# Altium project tnb_mns_slave.PrjPcb
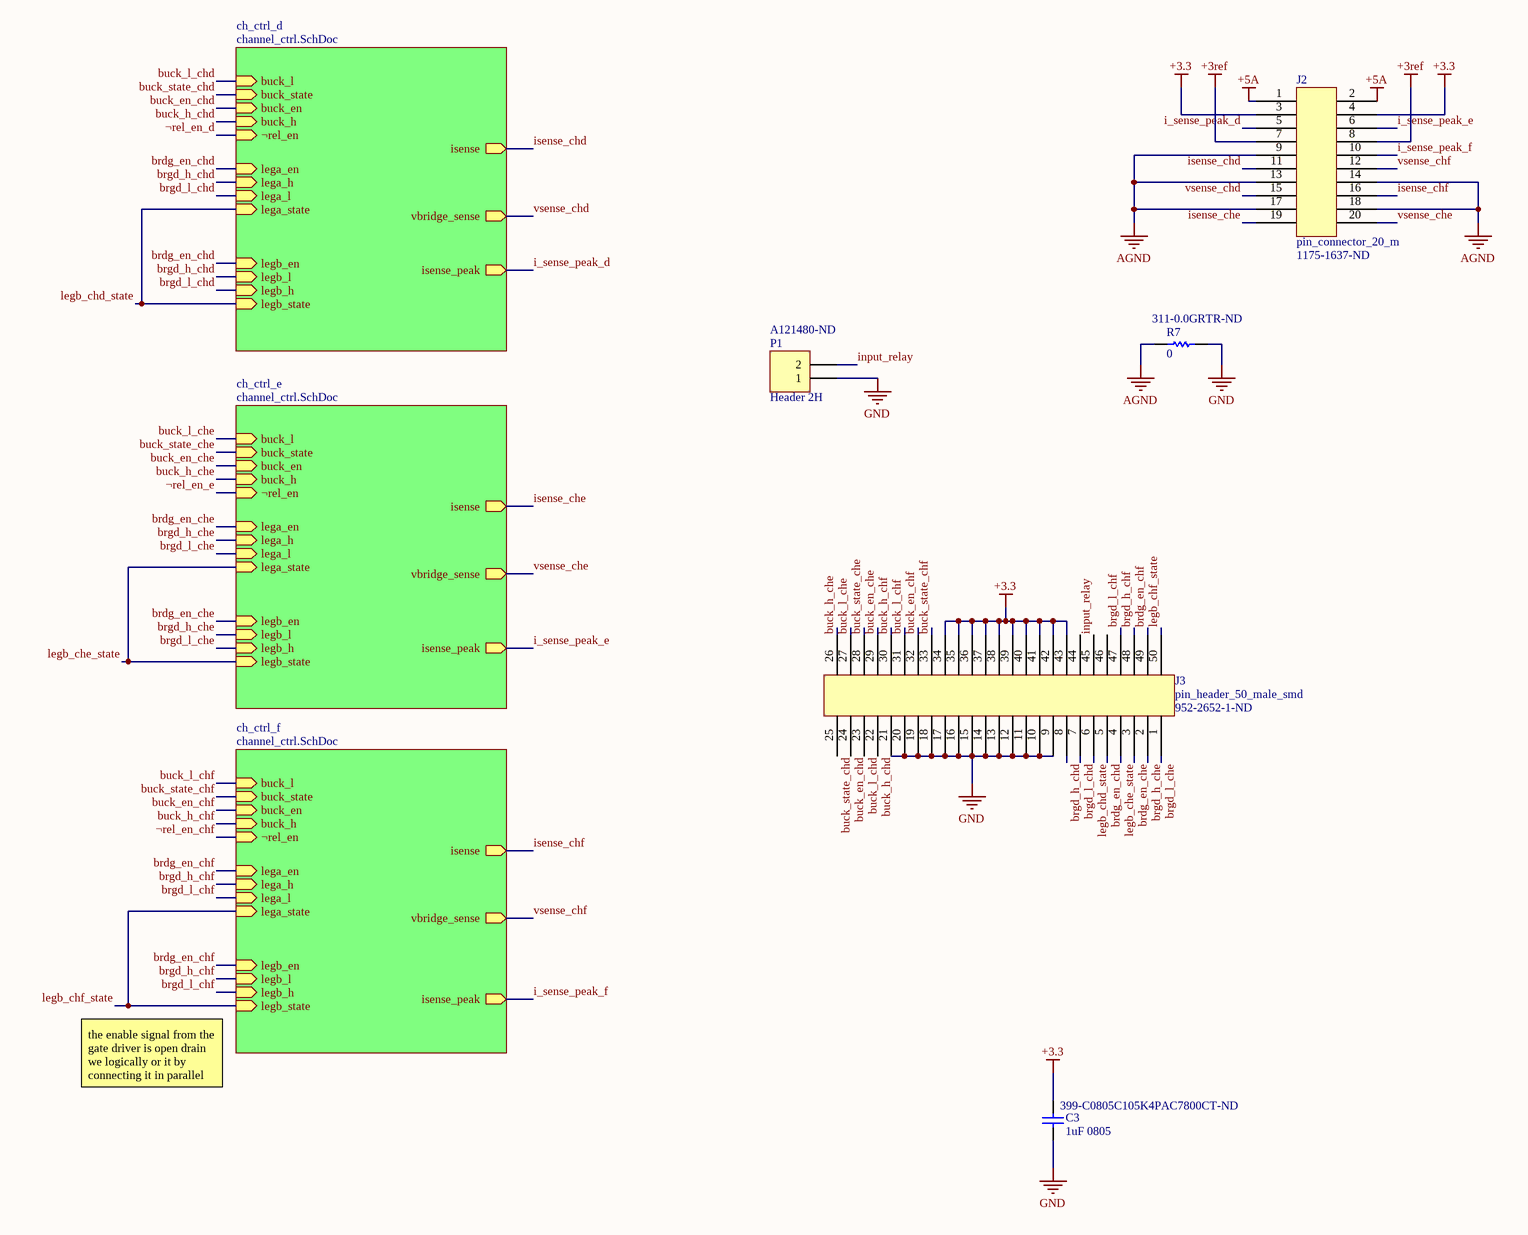
[diagram p0: tnb_mns_slave.SchDoc]
3 sheets, 92 parts. Net scope: hierarchical (ports join the sheet entries above them; power ports are global).
Board file: slave_card_pcb.PcbDoc
Sheets:
  tnb_mns_slave.SchDoc
    ch_ctrl_e = channel_ctrl.SchDoc
      isns = current_sense.SchDoc
    ch_ctrl_d = channel_ctrl.SchDoc
      isns = current_sense.SchDoc
    ch_ctrl_f = channel_ctrl.SchDoc
      isns = current_sense.SchDoc

## Sheet tnb_mns_slave.SchDoc
size A3; SheetNumber: 1; SheetTotal: 3

### Parts
C3  1uF 0805  Supplier Part Number 1: 399-C0805C105K4PAC7800CT-ND  [Model Name]
J2  pin_connector_20_m  Supplier Part Number 1: 1175-1637-ND  [PIN_20_MALE_3220-20-0300-00]
J3  pin_header_50_male_smd  Supplier Part Number 1: 952-2652-1-ND  [pin_connector_50_m_1.27_smd]
P1  Header 2H  Supplier Part Number 1: A121480-ND  [HEADER_1_2_f]
R7  0  Supplier Part Number 1: 311-0.0GRTR-ND  [RES 0603_1608]

### Sub-sheets
ch_ctrl_d = channel_ctrl.SchDoc: buck_l (in), buck_state (in), buck_en (in), buck_h (in), lega_en (in), lega_h (in), lega_l (in), lega_state (in), legb_en (in), legb_l (in), legb_h (in), legb_state (in), isense (out), vbridge_sense (out), isense_peak (out), ¬rel_en (in)
ch_ctrl_e = channel_ctrl.SchDoc: buck_l (in), buck_state (in), buck_en (in), buck_h (in), lega_en (in), lega_h (in), lega_l (in), lega_state (in), legb_en (in), legb_l (in), legb_h (in), legb_state (in), isense (out), vbridge_sense (out), ¬rel_en (in), isense_peak (out)
ch_ctrl_f = channel_ctrl.SchDoc: buck_l (in), buck_state (in), buck_en (in), buck_h (in), lega_en (in), lega_h (in), lega_l (in), lega_state (in), legb_en (in), legb_l (in), legb_h (in), legb_state (in), isense (out), vbridge_sense (out), ¬rel_en (in), isense_peak (out)

### Nets
+3.3: C3.2 J2.3 J2.4 J3.34 J3.35 J3.36 J3.37 J3.38 J3.39 J3.40 J3.41 J3.42 J3.43
+3ref: J2.7 J2.8
+5A: J2.1 J2.2
AGND: J2.9 J2.13 J2.14 J2.17 J2.18 R7.1
GND: C3.1 J3.9 J3.10 J3.11 J3.12 J3.13 J3.14 J3.15 J3.16 J3.17 J3.18 J3.19 J3.20 J3.21 P1.1 R7.2
brdg_en_chd: J3.5 ; sheet ch_ctrl_d/lega_en, sheet ch_ctrl_d/legb_en
brdg_en_che: J3.3 ; sheet ch_ctrl_e/lega_en, sheet ch_ctrl_e/legb_en
brdg_en_chf: J3.49 ; sheet ch_ctrl_f/lega_en, sheet ch_ctrl_f/legb_en
brgd_h_chd: J3.8 ; sheet ch_ctrl_d/lega_h, sheet ch_ctrl_d/legb_l
brgd_h_che: J3.2 ; sheet ch_ctrl_e/lega_h, sheet ch_ctrl_e/legb_l
brgd_h_chf: J3.48 ; sheet ch_ctrl_f/lega_h, sheet ch_ctrl_f/legb_l
brgd_l_chd: J3.7 ; sheet ch_ctrl_d/lega_l, sheet ch_ctrl_d/legb_h
brgd_l_che: J3.1 ; sheet ch_ctrl_e/lega_l, sheet ch_ctrl_e/legb_h
brgd_l_chf: J3.47 ; sheet ch_ctrl_f/lega_l, sheet ch_ctrl_f/legb_h
buck_en_chd: J3.24 ; sheet ch_ctrl_d/buck_en  [project net buck_en]
buck_en_che: J3.29 ; sheet ch_ctrl_e/buck_en  [project net buck_en]
buck_en_chf: J3.32 ; sheet ch_ctrl_f/buck_en  [project net buck_en]
buck_h_chd: J3.22 ; sheet ch_ctrl_d/buck_h  [project net buck_h]
buck_h_che: J3.26 ; sheet ch_ctrl_e/buck_h  [project net buck_h]
buck_h_chf: J3.30 ; sheet ch_ctrl_f/buck_h  [project net buck_h]
buck_l_chd: J3.23 ; sheet ch_ctrl_d/buck_l  [project net buck_l]
buck_l_che: J3.27 ; sheet ch_ctrl_e/buck_l  [project net buck_l]
buck_l_chf: J3.31 ; sheet ch_ctrl_f/buck_l  [project net buck_l]
buck_state_chd: J3.25 ; sheet ch_ctrl_d/buck_state  [project net buck_state]
buck_state_che: J3.28 ; sheet ch_ctrl_e/buck_state  [project net buck_state]
buck_state_chf: J3.33 ; sheet ch_ctrl_f/buck_state  [project net buck_state]
i_sense_peak_d: J2.5 ; sheet ch_ctrl_d/isense_peak
i_sense_peak_e: J2.6 ; sheet ch_ctrl_e/isense_peak
i_sense_peak_f: J2.10 ; sheet ch_ctrl_f/isense_peak
input_relay: J3.45 P1.2
isense_chd: J2.11 ; sheet ch_ctrl_d/isense  [project net i_sense]
isense_che: J2.19 ; sheet ch_ctrl_e/isense  [project net i_sense]
isense_chf: J2.16 ; sheet ch_ctrl_f/isense  [project net i_sense]
legb_chd_state: J3.6 ; sheet ch_ctrl_d/lega_state, sheet ch_ctrl_d/legb_state  [project net lega_state]
legb_che_state: J3.4 ; sheet ch_ctrl_e/lega_state, sheet ch_ctrl_e/legb_state  [project net lega_state]
legb_chf_state: J3.50 ; sheet ch_ctrl_f/lega_state, sheet ch_ctrl_f/legb_state  [project net lega_state]
vsense_chd: J2.15 ; sheet ch_ctrl_d/vbridge_sense
vsense_che: J2.20 ; sheet ch_ctrl_e/vbridge_sense
vsense_chf: J2.12 ; sheet ch_ctrl_f/vbridge_sense
¬rel_en_chf: sheet ch_ctrl_f/¬rel_en
¬rel_en_d: sheet ch_ctrl_d/¬rel_en
¬rel_en_e: sheet ch_ctrl_e/¬rel_en

Not connected (* = marked no-connect by the designer): J3 44 46

### Notes on the sheet
- the enable signal from the gate driver is open drain
  we logically or it by connecting it in parallel
- 1
- 2
- 3
- 4
- 5
- 6
- 7
- 8
- A
- B
- C
- D
- Project:
- Date:
- Drawing number:
- Rev:
- Format:
- A3
- Drawn by:
- Laboratory:
- Page
- Sheet:
- of
- File:

### Library data of the parts
C3 = Cap: Capacitor; Published: 8-Jun-2000; LatestRevisionDate: 17-Jul-2002; LatestRevisionNote: Re-released for DXP Platform.; PackageReference: RAD-0.3; Publisher: Altium Limited; PackageDescription: Radial Cap, Thru-Hole; 2 Leads; 0.3 in Pin Spacing; Value: 1uF; Supplier 1: Digi-Key
J3 = pin_header_50_male_smd: Mating Product : 952-2565-ND; Supplier 1: Digi-Key
P1 = Header 2H: Header, 2-Pin, Right Angle; LatestRevisionDate: 17-Jul-2002; LatestRevisionNote: Re-released for DXP Platform.; Publisher: Altium Limited; Supplier 1: Digi-Key
R7 = Res1: Resistor; Published: 8-Jun-2000; LatestRevisionDate: 17-Jul-2002; LatestRevisionNote: Re-released for DXP Platform.; PackageReference: AXIAL-0.3; Publisher: Altium Limited; PackageDescription: Axial Device, Thru-Hole; 2 Leads; 0.3 in Pin Spacing; Supplier 1: Digi-Key
J2 = pin_connector_20_m: Supplier 1: Digi-Key

## Sheet channel_ctrl.SchDoc
size A3; SheetNumber: 2; SheetTotal: 4
Used 3 times, as channels ch_ctrl_e, ch_ctrl_d, ch_ctrl_f. Parts and nets are listed once, with the designators drawn on the sheet.
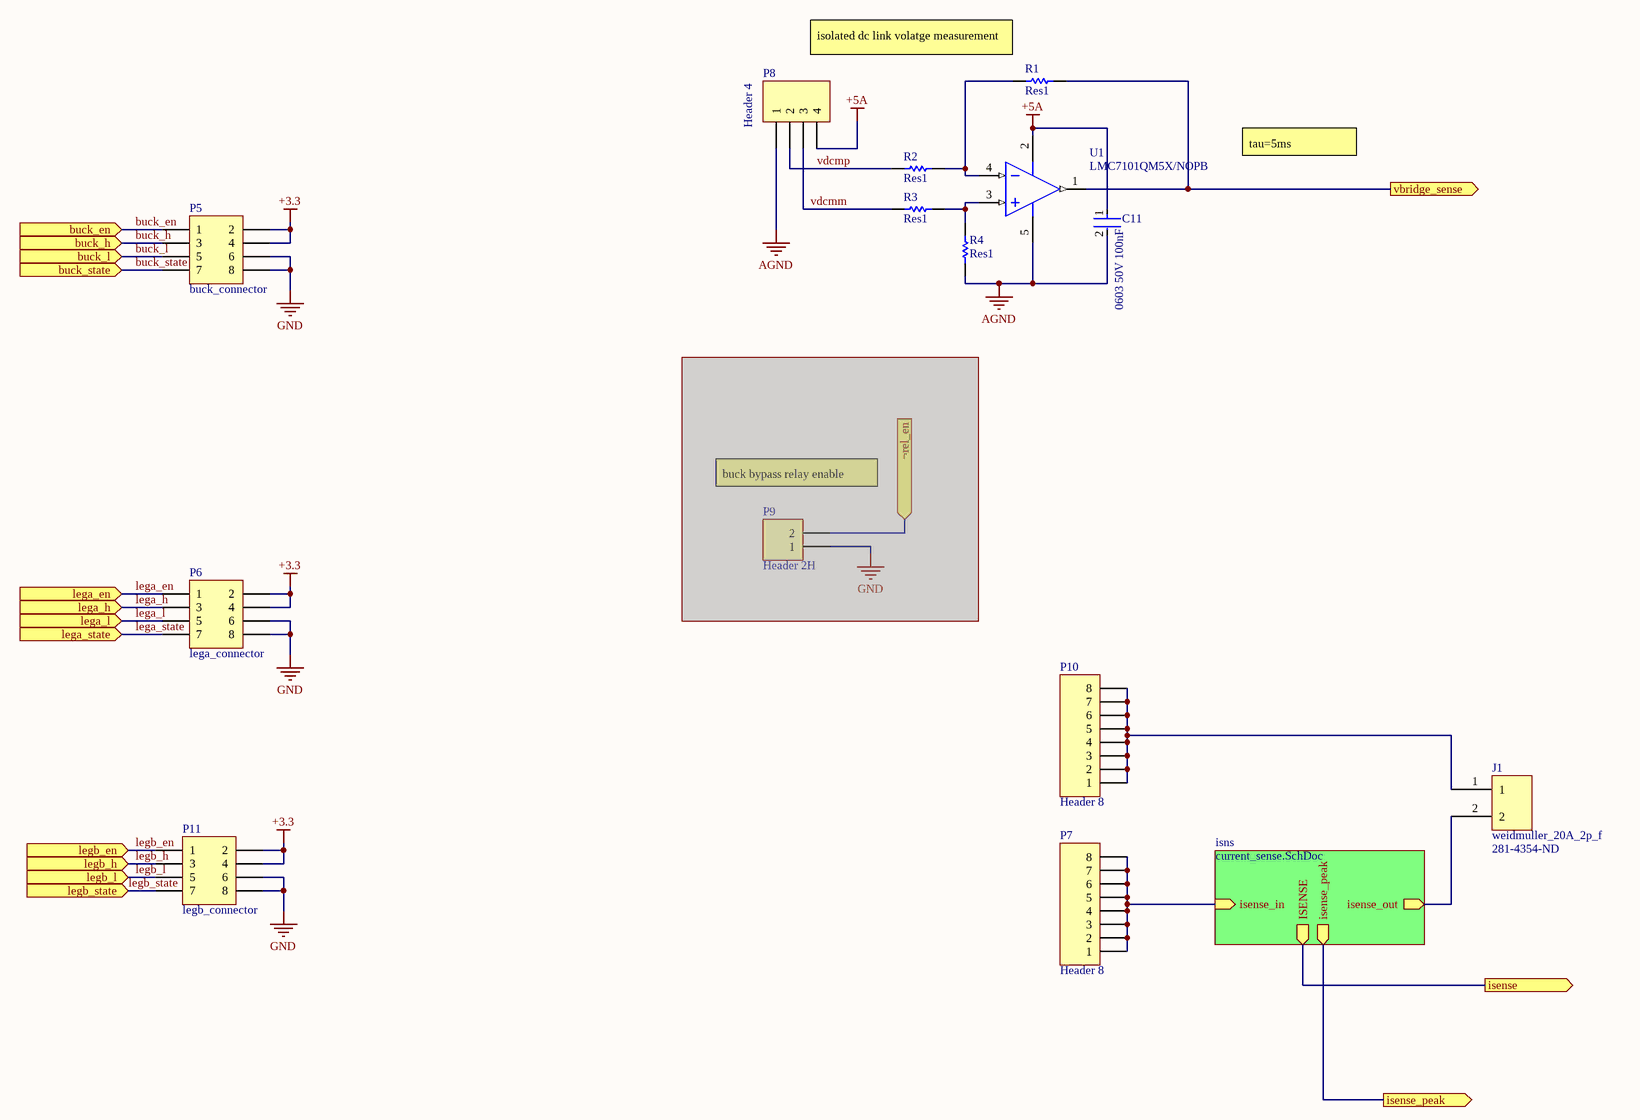
[diagram p1: channel_ctrl.SchDoc]

### Parts
C11  0603 50V 100nF  [FP-CGA3E-0_3-0_1-IPC_A]
J1  weidmuller_20A_2p_f  Supplier Part Number 1: 281-4354-ND  [weidmuller_19A_2p_m]
P5  buck_connector  [header_4_2_f]
P6  lega_connector  [header_4_2_f]
P7  Header 8  [header_4_2_f]
P8  Header 4  [header_2_2_f]
P9  Header 2H  [HEADER_1_2_f]  (masked out: inside a compile mask, not in the netlist)
P10  Header 8  [header_4_2_f]
P11  legb_connector  [header_4_2_f]
R1  Res1  [RES 0805_2012]
R2  Res1  [RES 0603_1608]
R3  Res1  [RES 0603_1608]
R4  Res1  [RES 0805_2012]
U1  LMC7101QM5X/NOPB  [DBV0005A_M]

### Sub-sheets
isns = current_sense.SchDoc: isense_in (in), isense_out (out), ISENSE (out), isense_peak (out)

### Ports
buck_en (in), buck_h (in), buck_l (in), buck_state (in), isense (out), isense_peak (out), lega_en (in), lega_h (in), lega_l (in), lega_state (in), legb_en (in), legb_h (in), legb_l (in), legb_state (in), vbridge_sense (out), ¬rel_en (in)

### Nets
+3.3: P5.2 P5.4 P6.2 P6.4 P11.2 P11.4
+5A: C11.1 P8.4 U1.2(V+)
AGND: C11.2 P8.1 R4.1 U1.5(V-)
GND: P5.6 P5.8 P6.6 P6.8 P11.6 P11.8
buck_en: P5.1 ; port buck_en
buck_h: P5.3 ; port buck_h
buck_l: P5.5 ; port buck_l
buck_state: P5.7 ; port buck_state
isense: port isense, sheet isns/ISENSE
isense_peak: port isense_peak, sheet isns/isense_peak
lega_en: P6.1 ; port lega_en
lega_h: P6.3 ; port lega_h
lega_l: P6.5 ; port lega_l
lega_state: P6.7 ; port lega_state
legb_en: P11.1 ; port legb_en
legb_h: P11.3 ; port legb_h
legb_l: P11.5 ; port legb_l
legb_state: P11.7 ; port legb_state
vbridge_sense: R1.2 U1.1(OUT) ; port vbridge_sense
vdcmm: P8.3 R3.1
vdcmp: P8.2 R2.1
NetJ1_1: J1.1 P10.1 P10.2 P10.3 P10.4 P10.5 P10.6 P10.7 P10.8
NetJ1_2: J1.2 ; sheet isns/isense_out
NetP7_1: P7.1 P7.2 P7.3 P7.4 P7.5 P7.6 P7.7 P7.8 ; sheet isns/isense_in
NetR1_1: R1.1 R2.2 U1.4(IN-)
NetR3_2: R3.2 R4.2 U1.3(IN+)

### Channels
ch_ctrl_e: designators end in _ch_ctrl_e; ports buck_en=buck_en buck_h=buck_h buck_l=buck_l buck_state=buck_state isense=i_sense isense_peak=i_sense_peak_e lega_en=brdg_en_che lega_h=brgd_h_che lega_l=brgd_l_che lega_state=lega_state legb_en=brdg_en_che legb_h=brgd_l_che legb_l=brgd_h_che legb_state=lega_state vbridge_sense=vsense_che
ch_ctrl_d: designators end in _ch_ctrl_d; ports buck_en=buck_en buck_h=buck_h buck_l=buck_l buck_state=buck_state isense=i_sense isense_peak=i_sense_peak_d lega_en=brdg_en_chd lega_h=brgd_h_chd lega_l=brgd_l_chd lega_state=lega_state legb_en=brdg_en_chd legb_h=brgd_l_chd legb_l=brgd_h_chd legb_state=lega_state vbridge_sense=vsense_chd
ch_ctrl_f: designators end in _ch_ctrl_f; ports buck_en=buck_en buck_h=buck_h buck_l=buck_l buck_state=buck_state isense=i_sense isense_peak=i_sense_peak_f lega_en=brdg_en_chf lega_h=brgd_h_chf lega_l=brgd_l_chf lega_state=lega_state legb_en=brdg_en_chf legb_h=brgd_l_chf legb_l=brgd_h_chf legb_state=lega_state vbridge_sense=vsense_chf

### Notes on the sheet
- (near R1) isolated dc link volatge measurement
- tau=5ms
- (near P9) buck bypass relay enable
- 1
- 2
- 3
- 4
- 5
- 6
- 7
- 8
- A
- B
- C
- D
- Project:
- Date:
- Drawing number:
- Rev:
- Format:
- A3
- Drawn by:
- Laboratory:
- Page
- Sheet:
- of
- File:

### Library data of the parts
C11 = CMP-2000-07546-2: Cap Ceramic 100nF 50V X7R 10% Pad SMD 0603 +125°C Automotive T/R / CGA3E2X7R1H104K080AA; Weight: 7.1E-05oz; Composition: Ceramic; Max Operating Temperature: 125°C; Termination: SMD/SMT; Dielectric: X7R; Length: 1.6mm; Package Quantity: 1; REACH SVHC: No SVHC; Lead Free: Lead Free; Case Code (Metric): 1608; Min Operating Temperature: -55°C; Packaging: Tape and Reel; Tolerance: 10%; Voltage Rating: 50V; Case Code (Imperial): 0603; Capacitance: 100nF; Case/Package: 0603; Voltage Rating (DC): 50V; Depth: 0.8mm; Radiation Hardening: No; Ratings: AEC-Q200; Mount: Surface Mount; Voltage: 50V; Thickness: 0.035inch; Width: 0.8mm; Height: 0.8mm
J1 = weidmuller_20A_2p_f: Connector Block 19A Male Receptor; Supplier 1: Digi-Key
P5 P6 P11 = Header 4X2: Header, 4-Pin, Dual row; LatestRevisionDate: 17-Jul-2002; LatestRevisionNote: Re-released for DXP Platform.; Publisher: Altium Limited; System: Connector
P7 P10 = Header 8: Header, 8-Pin; LatestRevisionDate: 17-Jul-2002; LatestRevisionNote: Re-released for DXP Platform.; Publisher: Altium Limited
P8 = Header 4: Header, 4-Pin; LatestRevisionDate: 17-Jul-2002; LatestRevisionNote: Re-released for DXP Platform.; Publisher: Altium Limited
P9 = Header 2H: Header, 2-Pin, Right Angle; LatestRevisionDate: 17-Jul-2002; LatestRevisionNote: Re-released for DXP Platform.; Publisher: Altium Limited
R1-R4 = Res1: Resistor; Value: 1K; Published: 8-Jun-2000; LatestRevisionDate: 17-Jul-2002; LatestRevisionNote: Re-released for DXP Platform.; PackageReference: AXIAL-0.3; Publisher: Altium Limited; PackageDescription: Axial Device, Thru-Hole; 2 Leads; 0.3 in Pin Spacing
U1 = CMP-0055-01329-3: Tiny Low power Operational Amplifier with Rail-to-Rail Input and Output, 5-pin SOT-23, Pb-Free; Manufacturer: Texas Instruments; CompType: Amplifiers; PackageTopMarking: AT6A*XTT; PowerWise: N; RoHS: Y; ComponentLink1URL: http://www.ti.com/general/docs/lit/getliterature.tsp?genericPartNumber=LMC7101Q-Q1&fileType=pdf; ComponentLink1Description: Datasheet URL; Package Reference: DBV0005A; PackageDescription: Molded SOT-23, .115 x .063 x .040 in Body, 5 Lead, .0375 in Pitch; PinCount: 5

## Sheet current_sense.SchDoc
size A3; SheetNumber: 3; SheetTotal: 4
Used 3 times, as channels ch_ctrl_e/isns, ch_ctrl_d/isns, ch_ctrl_f/isns. Parts and nets are listed once, with the designators drawn on the sheet.
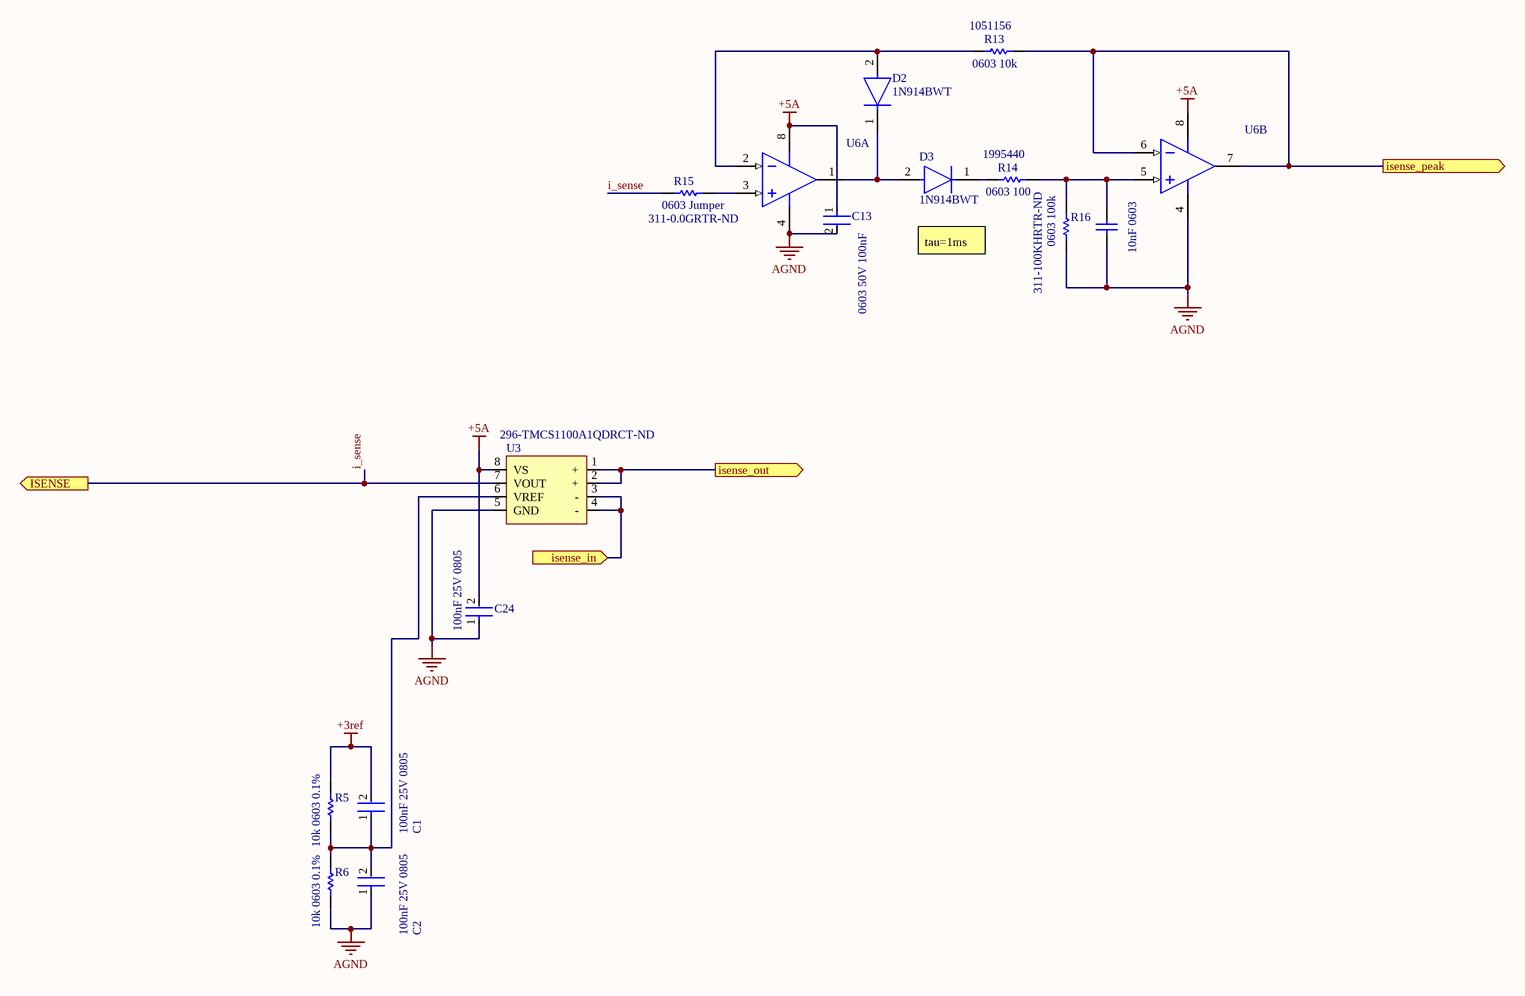
[diagram p2: current_sense.SchDoc]

### Parts
10nF_0603  06035C-103KAT2A  [CAPC1608X90X35LL15T15]  (value not drawn)
C1  100nF 25V 0805  [FP-CC0805-0_85-MFG]
C2  100nF 25V 0805  [FP-CC0805-0_85-MFG]
C13  0603 50V 100nF  [FP-CGA3E-0_3-0_1-IPC_A]
C24  100nF 25V 0805  [FP-CC0805-0_85-MFG]
D2  1N914BWT  [FP-502-01-MFG]
D3  1N914BWT  [FP-502-01-MFG]
R5  10k 0603 0.1%  [RESC1608X55X30ML20T20]
R6  10k 0603 0.1%  [RESC1608X55X30ML20T20]
R13  0603 10k  Supplier Part Number 1: 1051156  [RES 0603_1608]
R14  0603 100  Supplier Part Number 1: 1995440  [RES 0603_1608]
R15  0603 Jumper  Supplier Part Number 1: 311-0.0GRTR-ND  [RES 0603_1608]
R16  0603 100k  Supplier Part Number 1: 311-100KHRTR-ND  [RES 0603_1608]
U3  Supplier Part Number 1: 296-TMCS1100A1QDRCT-ND  [SOIC8]  (hidden comment: TMCS1100A1QDR)
U6  LTC6244HMS8#TRPBF  [LT-MS8-8_L]  (value not drawn)  (parts A,B of 2)

### Ports
ISENSE (out), isense_in (in), isense_out (out), isense_peak (out)

### Nets
+3ref: C1.2 R5.2
+5A: C13.1 C24.2 U3.8(VS) U6.8(V+)
AGND: 10nF_0603.1 C2.1 C13.2 C24.1 R6.1 R16.1 U3.5(GND) U6.4(V-)
i_sense: R15.1 U3.7(VOUT) ; port ISENSE
isense_in: U3.3(-) U3.4(-) ; port isense_in
isense_out: U3.1(+) U3.2(+) ; port isense_out
isense_peak: R13.2 U6.6(IN-_B) U6.7(OUT_B) ; port isense_peak
Net10nF_0603_2: 10nF_0603.2 R14.2 R16.2 U6.5(IN+_B)
NetC1_1: C1.1 C2.2 R5.1 R6.2 U3.6(VREF)
NetD2_1: D2.1(C) D3.2(A) U6.1(OUT_A)
NetD2_2: D2.2(A) R13.1 U6.2(IN-_A)
NetD3_1: D3.1(C) R14.1
NetR15_2: R15.2 U6.3(IN+_A)

### Channels
ch_ctrl_e/isns: designators 10nF 0603=10nF_0603_isns2 C1=C1_isns2 C2=C2_isns2 C13=C13_isns2 C24=C24_isns2 D2=D2_isns2 D3=D3_isns2 R5=R5_isns2 R6=R6_isns2 R13=R13_isns2 R14=R14_isns2 R15=R15_isns2 R16=R16_isns2 U3=U3_isns2 U6=U6_isns2; ports ISENSE=i_sense isense_in=NetP7_ch_ctrl_e_1 isense_out=NetJ1_ch_ctrl_e_2 isense_peak=i_sense_peak_e
ch_ctrl_d/isns: designators 10nF 0603=10nF_0603_isns1 C1=C1_isns1 C2=C2_isns1 C13=C13_isns1 C24=C24_isns1 D2=D2_isns1 D3=D3_isns1 R5=R5_isns1 R6=R6_isns1 R13=R13_isns1 R14=R14_isns1 R15=R15_isns1 R16=R16_isns1 U3=U3_isns1 U6=U6_isns1; ports ISENSE=i_sense isense_in=NetP7_ch_ctrl_d_1 isense_out=NetJ1_ch_ctrl_d_2 isense_peak=i_sense_peak_d
ch_ctrl_f/isns: designators 10nF 0603=10nF_0603_isns3 C1=C1_isns3 C2=C2_isns3 C13=C13_isns3 C24=C24_isns3 D2=D2_isns3 D3=D3_isns3 R5=R5_isns3 R6=R6_isns3 R13=R13_isns3 R14=R14_isns3 R15=R15_isns3 R16=R16_isns3 U3=U3_isns3 U6=U6_isns3; ports ISENSE=i_sense isense_in=NetP7_ch_ctrl_f_1 isense_out=NetJ1_ch_ctrl_f_2 isense_peak=i_sense_peak_f

### Notes on the sheet
- tau=1ms
- 1
- 2
- 3
- 4
- 5
- 6
- 7
- 8
- A
- B
- C
- D
- Project:
- Date:
- Drawing number:
- Rev:
- Format:
- A3
- Drawn by:
- Laboratory:
- Page
- Sheet:
- of
- File:

### Library data of the parts
10nF_0603 = CMP-2006-04374-1: Manufacturer: AVX Interconnect / Elco; Part Number: 06035C-103KAT2A
C1 C2 C24 = CMP-1036-04410-2: CAP CER 0.1UF 25V X7R 0805; Manufacturer Part Number: CC0805KRX7R8BB104; Manufacturer: Yageo; Tolerance: 0.1; Material: Ceramic; ComponentLink2URL: http://www.yageo.com/documents/recent/UPY-GPHC_Y5V_6.3V-to-50V_8.pdf; Category: Cap; Mouser Description: Multilayer Ceramic Capacitors MLCC - SMD/SMT 100nF 25V X7R 10%; Device Class L1: Passive Components; Footprint Url: http://www.yageo.com/exep/pages/download/literatures/UPY-C_GEN_24.pdf; Height: 0.95mm; Digikey Description: CAP CER 0.1UF 25V X7R 0805; Lead Free: Yes; Temperature Range High: +85°C; Temperature: -30°C to +85°C; Ipc Land Pattern Name: CAPC200125X85; Value: 100 nF; Capacitance: 100 nF; Automotive: No; Octopart: https://octopart.com/cc0805krx7r8bb104-yageo-39467766; Device Class L2: Capacitors; Temperature Characteristic: X7R; Voltage Rating: 25 V; ComponentLink2Description: Datasheet; Temperature Range Low: -30°C; Device Class L3: Ceramic Capacitors; RoHS: TRUE; Package: CC0805-0.85
C13 = CMP-2000-07546-2: as C11 on sheet channel_ctrl; Weight: 7.1E-05oz; Composition: Ceramic; Max Operating Temperature: 125°C; Termination: SMD/SMT; Dielectric: X7R; Length: 1.6mm; Package Quantity: 1; REACH SVHC: No SVHC; Lead Free: Lead Free; Case Code (Metric): 1608; Min Operating Temperature: -55°C; Packaging: Tape and Reel; Tolerance: 10%; Voltage Rating: 50V; Case Code (Imperial): 0603; Capacitance: 100nF; Case/Package: 0603; Voltage Rating (DC): 50V; Depth: 0.8mm; Radiation Hardening: No; Ratings: AEC-Q200; Mount: Surface Mount; Voltage: 50V; Thickness: 0.035inch; Width: 0.8mm; Height: 0.8mm
D2 D3 = CMP-07163-000008-1: DIODE GEN PURP 75V 200MA SOD523F; Manufacturer: ON Semiconductor; Forward Current: 300mA; Capacitance: 4pF; Max Junction Temp: +150°C; Reverse Voltage: 100V; Value: 4pF; Peak Reverse Current: 5uA; ComponentLink2Description: Datasheet; Package: 502-01; Manufacturer Part Number: 1N914BWT; Digikey Description: DIODE GEN PURP 75V 200MA SOD523F; Temperature Range High: +150°C; Temperature: -55°C to +150°C; Footprint Url: https://www.onsemi.com/pub/Collateral/502-01.PDF; Device Class L2: Diodes; Lead Free: Yes; Automotive: No; Category: Diode; Octopart: https://octopart.com/1n914bwt-on+semiconductor-84323166; Device Class L1: Discrete Semiconductors; Ipc Land Pattern Name: SODFL16080X60; Device Class L3: Rectifier Diodes; Height: 0.7mm; Max Repetitive Reverse Voltage: 75V; Mouser Description: Diodes - General Purpose, Power, Switching SINGLE JUNC. 100V 4.0NS COMP; Temperature Range Low: -55°C; ComponentLink2URL: https://www.onsemi.com/pub/Collateral/1N914BWT-D.pdf; RoHS: TRUE
R5 R6 = CMP-2000-00874-1: ERA-3AEB103V; Manufacturer: Panasonic; Part Number: ERA-3AEB103V
R13-R16 = Res1: Resistor; Value: 1K; Published: 8-Jun-2000; LatestRevisionDate: 17-Jul-2002; LatestRevisionNote: Re-released for DXP Platform.; PackageReference: AXIAL-0.3; Publisher: Altium Limited; PackageDescription: Axial Device, Thru-Hole; 2 Leads; 0.3 in Pin Spacing
  R13 R14: Supplier 1: RSComponents
  R15 R16: Supplier 1: Digi-Key
U3 = TMCS1100A1QDR: TMCS1100A1QDR / 50mV/A , 1.8mOhm , 3V-5.5V; Supplier 1: Digi-Key
U6 = CMP-0359-00848-2: Dual Channel, Low Noise, CMOS Operational Amplifier, RRO, 50 MHz Typical GBW, 35 V/us Typical SR, 2.8 to 6 V, 8-Pin SOP (MS8-8), High Temperature / Automotive, Pb-Free, Reel; Manufacturer: Linear Technology; Channels (#): 2; Is (mA) Typical: 6.25; Vos (mV) Typical: 0.04; GBW (MHz) Typical: 50; SR (V/us) Typical: 35; Vs Max (V): 6; Vs Min (V): 2.8; RoHS: Pb-Free; ComponentLink3Description: Package Specification; ComponentLink1URL: http://www.linear.com/; ComponentLink3URL: http://cds.linear.com/docs/en/packaging/05081610_G_SO8.pdf; Linear Technology Part Number: LTC6244; ComponentLink1Description: Manufacturer URL; PartNumber: LTC6244HMS8#TRPBF; Packing: Reel; ComponentLink2URL: http://cds.linear.com/docs/en/datasheet/6244fb.pdf; PackageVersion: Rev G; Mounting Technology: Surface Mount; ComponentLink2Description: Datasheet; DatasheetVersion: Rev. B; Type: VFB; PackageDescription: 8-Lead Plastic Small Outline, Body 3.9 x 4.9 mm, Pitch 1.27 mm; RevisionNote: URLs updated; PackageReference: LT-MS8-8

## Nets that join several sheets
+3.3: tnb_mns_slave (13 pins), ch_ctrl_e (6 pins), ch_ctrl_d (6 pins), ch_ctrl_f (6 pins)
+3ref: tnb_mns_slave (J2.7 J2.8), ch_ctrl_e/isns (C1_isns2.2 R5_isns2.2), ch_ctrl_d/isns (C1_isns1.2 R5_isns1.2), ch_ctrl_f/isns (C1_isns3.2 R5_isns3.2)
+5A: tnb_mns_slave (J2.1 J2.2), ch_ctrl_e (C11_ch_ctrl_e.1 P8_ch_ctrl_e.4 U1_ch_ctrl_e.2), ch_ctrl_e/isns (C13_isns2.1 C24_isns2.2 U3_isns2.8 U6_isns2.8), ch_ctrl_d (C11_ch_ctrl_d.1 P8_ch_ctrl_d.4 U1_ch_ctrl_d.2), ch_ctrl_d/isns (C13_isns1.1 C24_isns1.2 U3_isns1.8 U6_isns1.8), ch_ctrl_f (C11_ch_ctrl_f.1 P8_ch_ctrl_f.4 U1_ch_ctrl_f.2), ch_ctrl_f/isns (C13_isns3.1 C24_isns3.2 U3_isns3.8 U6_isns3.8)
AGND: tnb_mns_slave (6 pins), ch_ctrl_e (C11_ch_ctrl_e.2 P8_ch_ctrl_e.1 R4_ch_ctrl_e.1 U1_ch_ctrl_e.5), ch_ctrl_e/isns (8 pins), ch_ctrl_d (C11_ch_ctrl_d.2 P8_ch_ctrl_d.1 R4_ch_ctrl_d.1 U1_ch_ctrl_d.5), ch_ctrl_d/isns (8 pins), ch_ctrl_f (C11_ch_ctrl_f.2 P8_ch_ctrl_f.1 R4_ch_ctrl_f.1 U1_ch_ctrl_f.5), ch_ctrl_f/isns (8 pins)
GND: tnb_mns_slave (16 pins), ch_ctrl_e (6 pins), ch_ctrl_d (6 pins), ch_ctrl_f (6 pins)
brdg_en_chd: tnb_mns_slave (J3.5), ch_ctrl_d (P6_ch_ctrl_d.1 P11_ch_ctrl_d.1)
brdg_en_che: tnb_mns_slave (J3.3), ch_ctrl_e (P6_ch_ctrl_e.1 P11_ch_ctrl_e.1)
brdg_en_chf: tnb_mns_slave (J3.49), ch_ctrl_f (P6_ch_ctrl_f.1 P11_ch_ctrl_f.1)
brgd_h_chd: tnb_mns_slave (J3.8), ch_ctrl_d (P6_ch_ctrl_d.3 P11_ch_ctrl_d.5)
brgd_h_che: tnb_mns_slave (J3.2), ch_ctrl_e (P6_ch_ctrl_e.3 P11_ch_ctrl_e.5)
brgd_h_chf: tnb_mns_slave (J3.48), ch_ctrl_f (P6_ch_ctrl_f.3 P11_ch_ctrl_f.5)
brgd_l_chd: tnb_mns_slave (J3.7), ch_ctrl_d (P6_ch_ctrl_d.5 P11_ch_ctrl_d.3)
brgd_l_che: tnb_mns_slave (J3.1), ch_ctrl_e (P6_ch_ctrl_e.5 P11_ch_ctrl_e.3)
brgd_l_chf: tnb_mns_slave (J3.47), ch_ctrl_f (P6_ch_ctrl_f.5 P11_ch_ctrl_f.3)
buck_en: tnb_mns_slave (J3.24), ch_ctrl_d (P5_ch_ctrl_d.1)
buck_en: tnb_mns_slave (J3.29), ch_ctrl_e (P5_ch_ctrl_e.1)
buck_en: tnb_mns_slave (J3.32), ch_ctrl_f (P5_ch_ctrl_f.1)
buck_h: tnb_mns_slave (J3.22), ch_ctrl_d (P5_ch_ctrl_d.3)
buck_h: tnb_mns_slave (J3.26), ch_ctrl_e (P5_ch_ctrl_e.3)
buck_h: tnb_mns_slave (J3.30), ch_ctrl_f (P5_ch_ctrl_f.3)
buck_l: tnb_mns_slave (J3.23), ch_ctrl_d (P5_ch_ctrl_d.5)
buck_l: tnb_mns_slave (J3.27), ch_ctrl_e (P5_ch_ctrl_e.5)
buck_l: tnb_mns_slave (J3.31), ch_ctrl_f (P5_ch_ctrl_f.5)
buck_state: tnb_mns_slave (J3.25), ch_ctrl_d (P5_ch_ctrl_d.7)
buck_state: tnb_mns_slave (J3.28), ch_ctrl_e (P5_ch_ctrl_e.7)
buck_state: tnb_mns_slave (J3.33), ch_ctrl_f (P5_ch_ctrl_f.7)
i_sense: tnb_mns_slave (J2.11), ch_ctrl_d/isns (R15_isns1.1 U3_isns1.7)
i_sense: tnb_mns_slave (J2.16), ch_ctrl_f/isns (R15_isns3.1 U3_isns3.7)
i_sense: tnb_mns_slave (J2.19), ch_ctrl_e/isns (R15_isns2.1 U3_isns2.7)
i_sense_peak_d: tnb_mns_slave (J2.5), ch_ctrl_d/isns (R13_isns1.2 U6_isns1.6 U6_isns1.7)
i_sense_peak_e: tnb_mns_slave (J2.6), ch_ctrl_e/isns (R13_isns2.2 U6_isns2.6 U6_isns2.7)
i_sense_peak_f: tnb_mns_slave (J2.10), ch_ctrl_f/isns (R13_isns3.2 U6_isns3.6 U6_isns3.7)
lega_state: tnb_mns_slave (J3.4), ch_ctrl_e (P6_ch_ctrl_e.7 P11_ch_ctrl_e.7)
lega_state: tnb_mns_slave (J3.6), ch_ctrl_d (P6_ch_ctrl_d.7 P11_ch_ctrl_d.7)
lega_state: tnb_mns_slave (J3.50), ch_ctrl_f (P6_ch_ctrl_f.7 P11_ch_ctrl_f.7)
NetJ1_ch_ctrl_d_2: ch_ctrl_d (J1_ch_ctrl_d.2), ch_ctrl_d/isns (U3_isns1.1 U3_isns1.2)
NetJ1_ch_ctrl_e_2: ch_ctrl_e (J1_ch_ctrl_e.2), ch_ctrl_e/isns (U3_isns2.1 U3_isns2.2)
NetJ1_ch_ctrl_f_2: ch_ctrl_f (J1_ch_ctrl_f.2), ch_ctrl_f/isns (U3_isns3.1 U3_isns3.2)
NetP7_ch_ctrl_d_1: ch_ctrl_d (8 pins), ch_ctrl_d/isns (U3_isns1.3 U3_isns1.4)
NetP7_ch_ctrl_e_1: ch_ctrl_e (8 pins), ch_ctrl_e/isns (U3_isns2.3 U3_isns2.4)
NetP7_ch_ctrl_f_1: ch_ctrl_f (8 pins), ch_ctrl_f/isns (U3_isns3.3 U3_isns3.4)
vsense_chd: tnb_mns_slave (J2.15), ch_ctrl_d (R1_ch_ctrl_d.2 U1_ch_ctrl_d.1)
vsense_che: tnb_mns_slave (J2.20), ch_ctrl_e (R1_ch_ctrl_e.2 U1_ch_ctrl_e.1)
vsense_chf: tnb_mns_slave (J2.12), ch_ctrl_f (R1_ch_ctrl_f.2 U1_ch_ctrl_f.1)